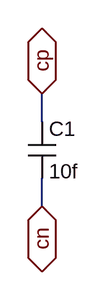
[diagram p0: schematic unit_cap.asc]
unit_cap.asc, the LTspice schematic file:
Version 4
SHEET 1 880 680
WIRE 240 160 240 128
WIRE 240 256 240 224
FLAG 240 256 cn
IOPIN 240 256 BiDir
FLAG 240 128 cp
IOPIN 240 128 BiDir
SYMBOL cap 224 160 R0
SYMATTR InstName C1
SYMATTR Value 10f

The netlist it stands for:
* unit_cap.asc
C1 cp cn 10f
.backanno
.end